# Altium schematic sheet WiFi_BLE2.SchDoc
size A
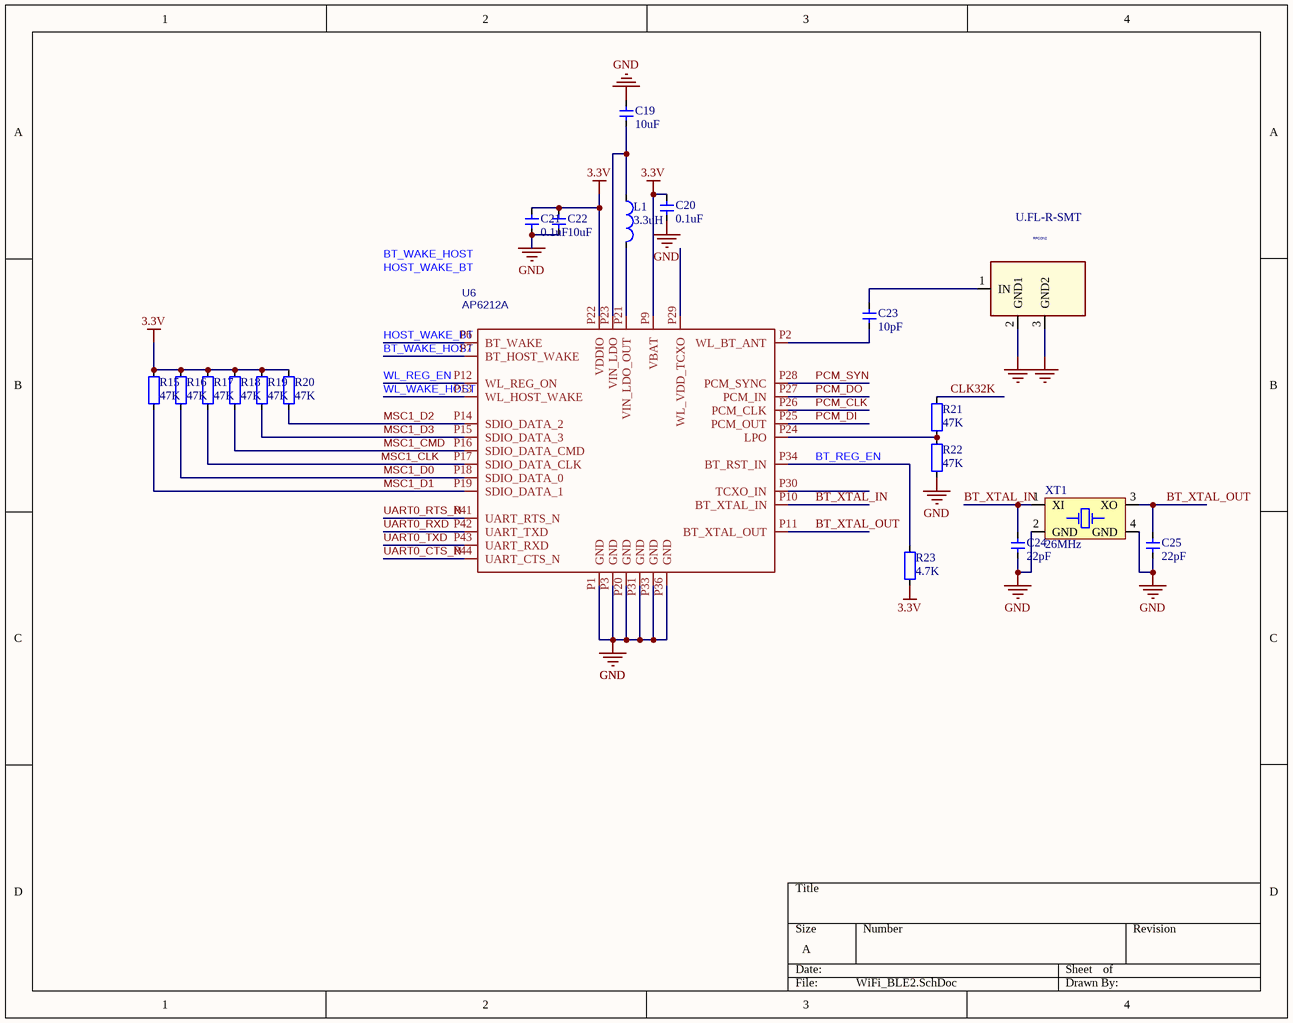
[diagram p0: WiFi_BLE2.SchDoc]

## Parts
C19  value 10uF  [CAP_0805]  (hidden comment: Cap_0805)
C20  value 0.1uF  [CAP_0402]  (hidden comment: Cap_0402)
C21  value 0.1uF  [CAP_0402]  (hidden comment: Cap_0402)
C22  value 10uF  [CAP_0805]  (hidden comment: Cap_0805)
C23  value 10pF  [CAP_0402]  (hidden comment: Cap_0402)
C24  value 22pF  [CAP_0402]  (hidden comment: Cap_0402)
C25  value 22pF  [CAP_0402]  (hidden comment: Cap_0402)
L1  value 3.3uH  [IND_0402]  (hidden comment: Ind_0402)
R15  value 47K  [RES_0402]  (hidden comment: Res_0402)
R16  value 47K  [RES_0402]  (hidden comment: Res_0402)
R17  value 47K  [RES_0402]  (hidden comment: Res_0402)
R18  value 47K  [RES_0402]  (hidden comment: Res_0402)
R19  value 47K  [RES_0402]  (hidden comment: Res_0402)
R20  value 47K  [RES_0402]  (hidden comment: Res_0402)
R21  value 47K  [RES_0402]  (hidden comment: Res_0402)
R22  value 47K  [RES_0402]  (hidden comment: Res_0402)
R23  value 4.7K  [RES_0402]  (hidden comment: Res_0402)
RFCON2  U.FL-R-SMT  [ANTENNA_DN007N]
U6  AP6212A  [AP6210]
XT1  value 26MHz  [XT_3225_4]  (hidden comment: XTAL_3225_4P)

## Nets
3.3V: C20.2 C21.2 C22.2 R15.2 R16.2 R17.2 R18.2 R19.2 R20.2 R23.1 U6.P9(VBAT) U6.P22(VDDIO)
GND: C19.2 C20.1 C21.1 C22.1 C24.1 C25.1 R22.1 RFCON2.2(GND1) RFCON2.3(GND2) U6.P1(GND) U6.P3(GND) U6.P20(GND) U6.P31(GND) U6.P33(GND) U6.P36(GND) XT1.2(GND) XT1.4(GND)
BT_REG_EN: R23.2 U6.P34(BT_RST_IN)
BT_WAKE_HOST: U6.P7(BT_HOST_WAKE)
BT_XTAL_IN: C24.2 U6.P10(BT_XTAL_IN) XT1.1(XI)
BT_XTAL_OUT: C25.2 U6.P11(BT_XTAL_OUT) XT1.3(XO)
CLK32K: R21.2
HOST_WAKE_BT: U6.P6(BT_WAKE)
MSC1_CLK: R17.1 U6.P17(SDIO_DATA_CLK)
MSC1_CMD: R18.1 U6.P16(SDIO_DATA_CMD)
MSC1_D0: R16.1 U6.P18(SDIO_DATA_0)
MSC1_D1: R15.1 U6.P19(SDIO_DATA_1)
MSC1_D2: R20.1 U6.P14(SDIO_DATA_2)
MSC1_D3: R19.1 U6.P15(SDIO_DATA_3)
PCM_CLK: U6.P26(PCM_CLK)
PCM_DI: U6.P25(PCM_OUT)
PCM_DO: U6.P27(PCM_IN)
PCM_SYN: U6.P28(PCM_SYNC)
UART0_CTS_N: U6.P44(UART_CTS_N)
UART0_RTS_N: U6.P41(UART_RTS_N)
UART0_RXD: U6.P42(UART_TXD)
UART0_TXD: U6.P43(UART_RXD)
WL_REG_EN: U6.P12(WL_REG_ON)
WL_WAKE_HOST: U6.P13(WL_HOST_WAKE)
NetC19_1: C19.1 L1.1 U6.P23(VIN_LDO)
NetC23_1: C23.1 U6.P2(WL_BT_ANT)
NetC23_2: C23.2 RFCON2.1(IN)
NetL1_2: L1.2 U6.P21(VIN_LDO_OUT)
NetR21_1: R21.1 R22.2 U6.P24(LPO)

Not connected (* = marked no-connect by the designer): U6 P29(WL_VDD_TCXO) P30(TCXO_IN)

## Notes on the sheet
- Labels drawn without touching a wire or pin: BT_WAKE_HOST, HOST_WAKE_BT

## Library data of the parts
C19 C22 = Cap_0805: Capacitor
C20 C21 C23-C25 = Cap_0402: Capacitor
L1 = Ind_0402: Inductor
R15-R23 = Res_0402: Resistor
RFCON2 = ANT_0: 1ST PART DESCRIPTION: U.FL-R-SMT
U6 = AP6210: timeStamp: 1455127572; BOM_Manufacturer Part: ?; spicePre: U
XT1 = XTAL_3225_4P: Crystal Oscillator